# EAGLE schematic main (EAGLE 6.6.0)
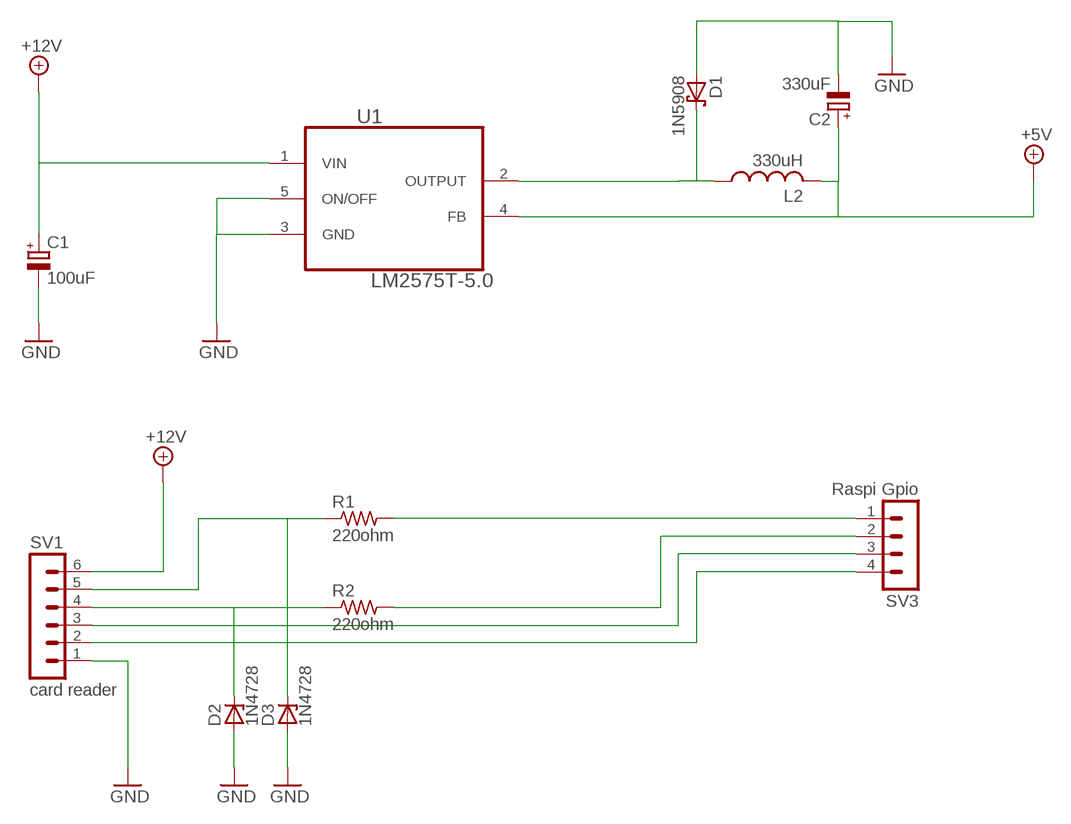
[diagram p0: schematic, sheet 1]

## Parts
C1  100uF  CPOL-EUE10-25  [EB25D]
C2  330uF  CPOL-EUE10-25  [EB25D]
D1  1N5908  [C4111-15]
D2  1N4728  [DO41Z10]
D3  1N4728  [DO41Z10]
L2  330uH  L-USTJ3-U2  [TJ3-U2]
R1  220ohm  R-US_0204/7  [0204/7]
R2  220ohm  R-US_0204/7  [0204/7]
SV1  card reader  MA06-1  [MA06-1]
SV3  Raspi Gpio  MA04-1  [MA04-1]
U1  LM2575T-5.0  [TO170P470X1016X2092-5P]

## Nets
+5V: C2.+ L2.2 U1.4(FB)
+12V: C1.+ SV1.6 U1.1(VIN)
GND: C1.- C2.- D1.A D2.A D3.A SV1.1 U1.3(GND) U1.5(ON/OFF)
N$1: D1.C L2.1 U1.2(OUTPUT)
N$2: R2.2 SV3.2
N$3: R1.2 SV3.1
N$4: SV1.3 SV3.3
N$5: D3.C R1.1 SV1.5
N$6: D2.C R2.1 SV1.4
N$7: SV1.2 SV3.4

## Library data of the parts
C1 C2 = resistor:CPOL-EU: POLARIZED CAPACITOR, European symbol
D1 = diode:1N5908: DIODE schottky
D2 D3 = diode:1N4728: Z DIODE 3.3 V, 1W, 5 percent
L2 = rcl:L-US: INDUCTOR, American symbol
R1 R2 = resistor:R-US_: RESISTOR, American symbol
SV1 = con-lstb:MA06-1: PIN HEADER; OC_FARNELL: unknown; OC_NEWARK: unknown
SV3 = con-lstb:MA04-1: PIN HEADER; OC_FARNELL: unknown; OC_NEWARK: unknown
U1 = NSC_By_element14_Batch_1.1:LM2575T-5.0: IC, STEP-DOWN REGULATOR; MPN: LM2575T-5.0; OC_FARNELL: 9488090; OC_NEWARK: 41K3670; PACKAGE: TO220-5; SUPPLIER: National Semiconductor